# EasyEDA Pro project Clock.eprj

# Board PCB1
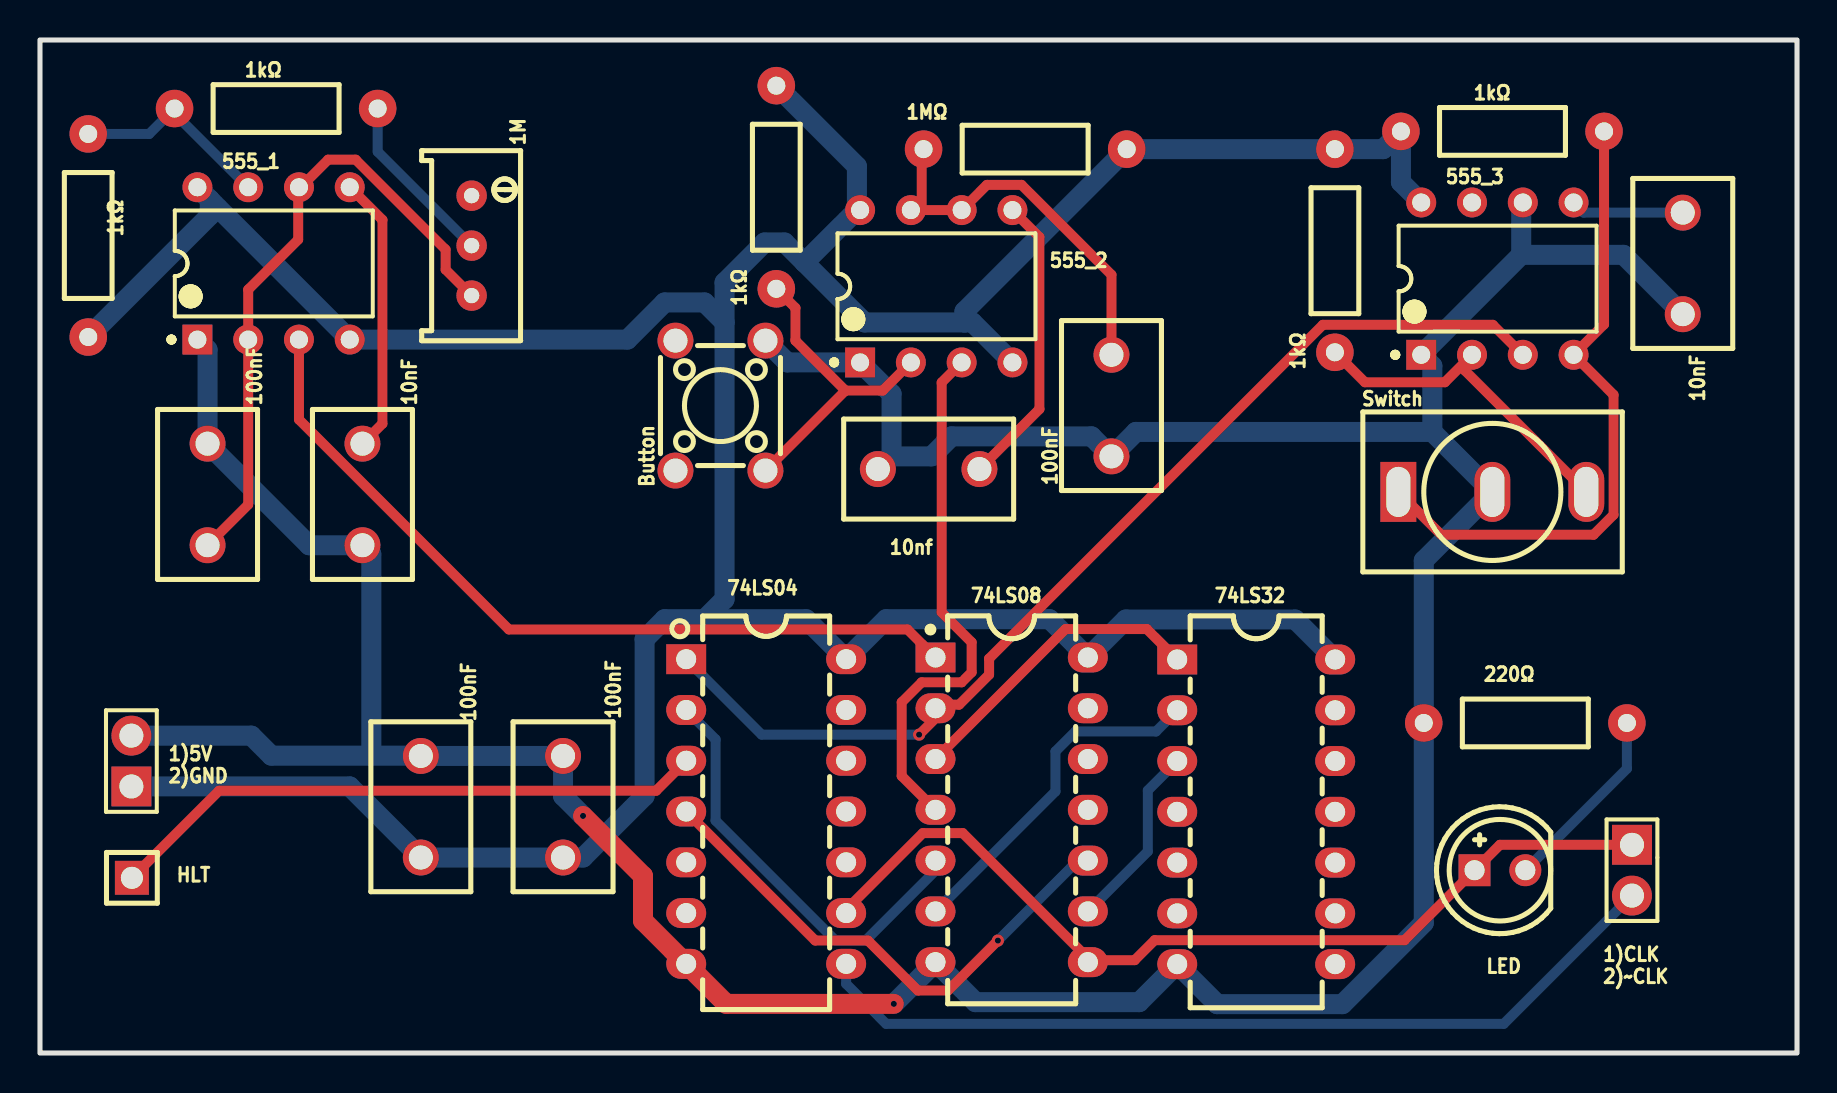
[diagram p0: board, top side]
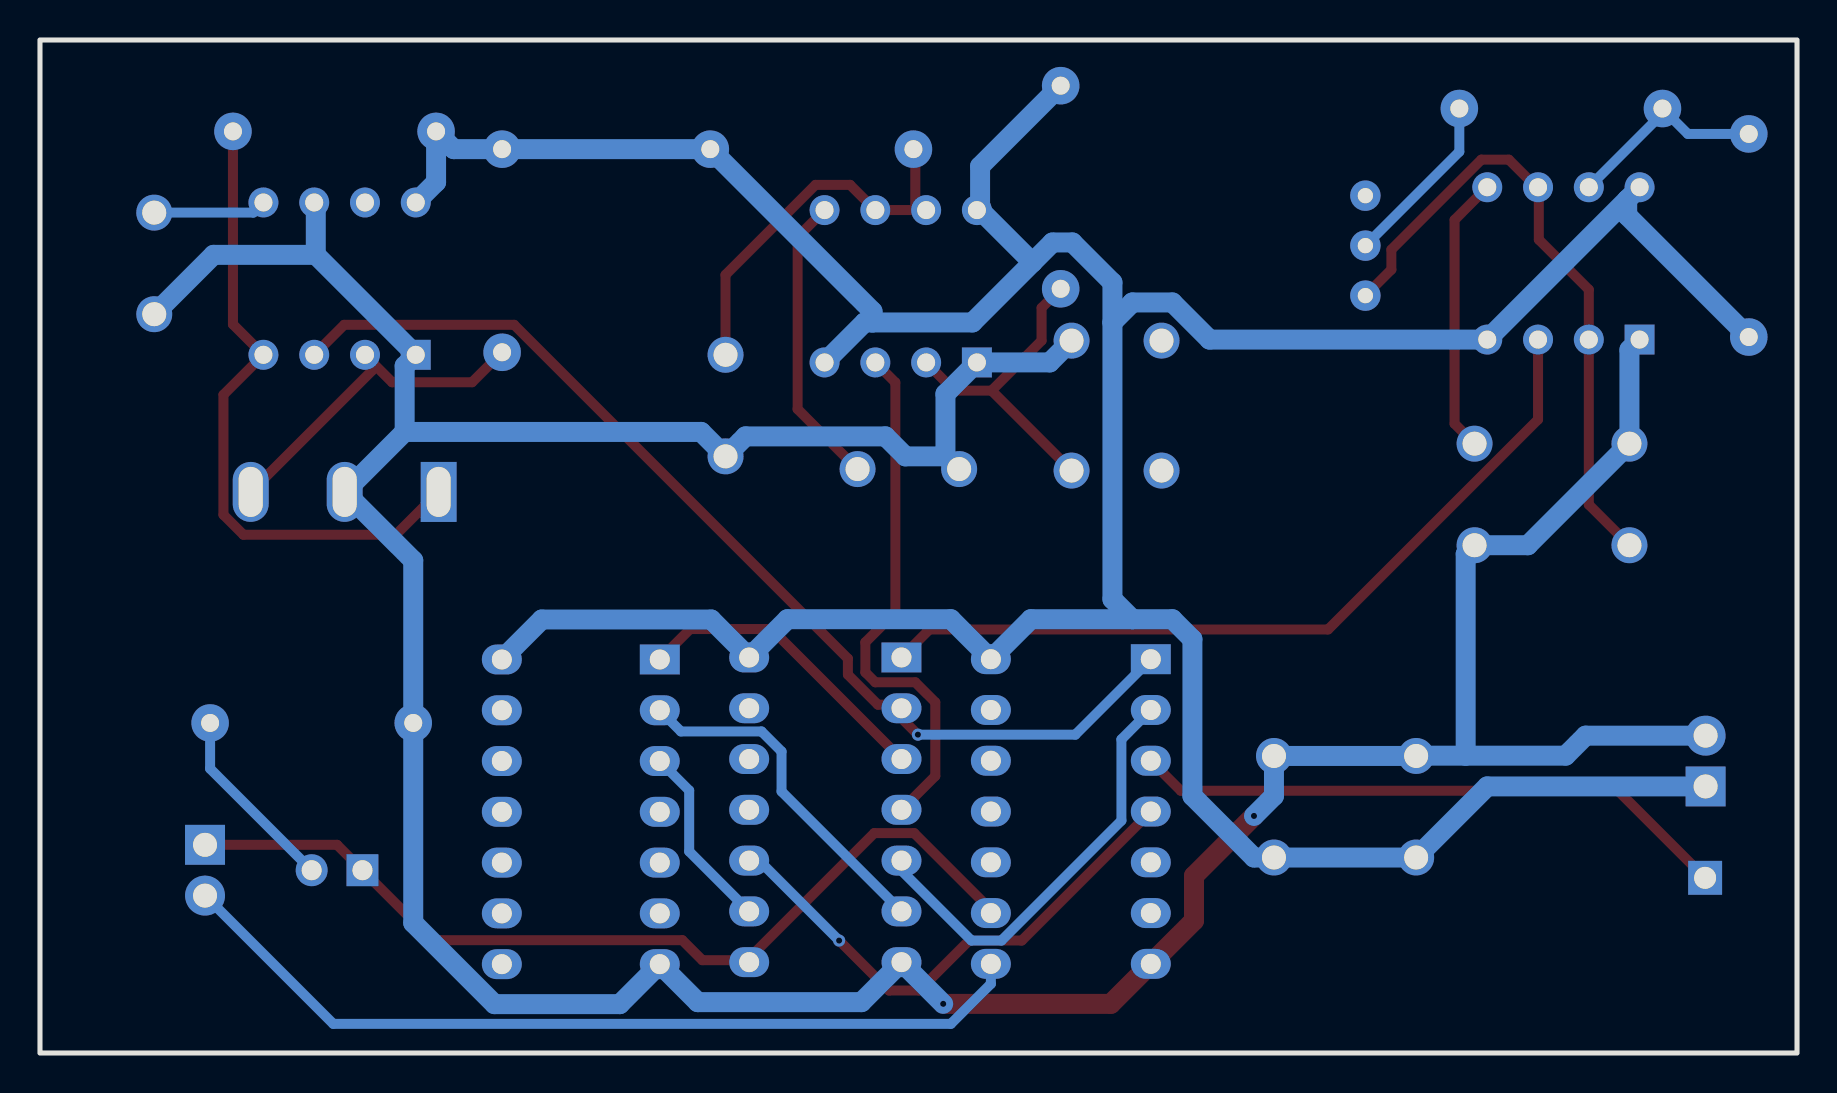
[diagram p1: board, bottom side, seen from below]

Outline 87.88 x 50.67 mm; copper layers: Top Layer, Bottom Layer. Coordinates in mm from the lower left corner of the outline.
Outline path: rectangle 0,50.67 87.88,0
Stack: Top Layer 0.035mm / Dielectric1 1.51mm FR4 er 4.5 / Bottom Layer 0.035mm

## Design rules (mm)
template: Custom Config
spacing copperThickness1oz (default): track to track 0.102, other pairs 0.152 to 0.3
spacing copperThickness2oz: track to track 0.203, other pairs 0.152 to 0.3
track width copperThickness1oz (default): min 0.127, default 0.5, max 2.54
track width copperThickness2oz: min 0.203, default 1, max 2.54
differential pair differentialPair (default): width min 0.127, default 0.254, max 2.54; gap min 0.152, default 0.152
via viaSize (default): diameter min 0.5, default 0.61, max 10; hole min 0.3, default 0.305, max 6.3
net +5V uses copperThickness2oz
net GND uses copperThickness2oz

## Placement (name value [footprint] x y rotation side)
1)5V
2)GND  -  [HDR-TH_2P-P2.54-V-M]  4.57 14.61 90 top
1)CLK
2)~CLK  -  [HDR-TH_2P-P2.54-V-M]  79.63 9.14 270 top
1kΩ  -  [R_AXIAL-0.4]  2.41 40.89 270 top
1kΩ#2  -  [R_AXIAL-0.4]  11.81 47.24 0 top
1kΩ#3  -  [R_AXIAL-0.4]  64.77 40.13 90 top
1kΩ#4  -  [R_AXIAL-0.4]  73.15 46.1 180 top
1kΩ#5  -  [R_AXIAL-0.4]  36.83 43.31 90 top
1M  -  [RES-ADJ-TH_3P-L10.0-W10.0-P2.50-L]  21.59 40.39 270 top
1MΩ  -  [R_AXIAL-0.4]  49.28 45.21 0 top
10nF  -  [CAP-TH_L8.5-W5.0-P5.00-D1.2]  16.13 27.94 270 top
10nf  -  [CAP-TH_L8.5-W5.0-P5.00-D1.2]  44.45 29.21 0 top
10nF#2  -  [CAP-TH_L8.5-W5.0-P5.00-D1.2]  82.17 39.5 90 top
74LS04  -  [PDIP-14_L19.7-W6.6-P2.54-LS8.3-BL]  36.32 12.08 270 top
74LS08  -  [PDIP-14_L19.3-W6.4-P2.54-LS7.9-BL-1]  48.6 12.17 270 top
74LS32  -  [PDIP-14_L19.6-W6.5-P2.54-LS7.9-BL]  60.83 12.06 270 top
100nF  -  [CAP-TH_L8.5-W5.0-P5.00-D1.2]  8.38 27.94 270 top
100nF#2  -  [CAP-TH_L8.5-W5.0-P5.00-D1.2]  53.59 32.39 90 top
100nF#3  -  [CAP-TH_L8.5-W5.0-P5.00-D1.2]  26.16 12.32 270 top
100nF#4  -  [CAP-TH_L8.5-W5.0-P5.00-D1.2]  19.05 12.32 270 top
220Ω  -  [R_AXIAL-0.4]  74.3 16.51 0 top
555_1  -  [DIP-8_L9.8-W6.6-P2.54-LS7.6-BL]  11.68 39.5 0 top
555_2  -  [DIP-8_L9.8-W6.6-P2.54-LS7.6-BL]  44.83 38.35 0 top
555_3  -  [DIP-8_L9.8-W6.6-P2.54-LS7.6-BL]  72.9 38.73 0 top
Button  -  [SW-TH_4P-L6.0-W6.0-P4.50-LS6.5]  34.04 32.39 90 top
HLT  -  [HDR-TH_1P-P2.54-V-M]  4.6 8.76 0 top
LED  -  [LED-TH_BD5.8-P2.54-FD]  73.03 9.14 0 top
Switch  -  [SW-TH_MT-0-103-A101-M200-RS]  72.64 28.07 0 top

## Footprints (pads in the part's own frame, mm; a bottom-side part is the same pattern mirrored in y, then rotated)
CAP-TH_L8.5-W5.0-P5.00-D1.2
  round 1.8 hole 1.2: 1(-2.54,0) 2(2.54,0)
DIP-8_L9.8-W6.6-P2.54-LS7.6-BL
  rect 1.5x1.5 hole 0.9: 1(-3.81,-3.81)
  round 1.5 hole 0.9: 2(-1.27,-3.81) 3(1.27,-3.81) 4(3.81,-3.81) 5(3.81,3.81) 6(1.27,3.81) 7(-1.27,3.81) 8(-3.81,3.81)
HDR-TH_1P-P2.54-V-M
  rect 1.7x1.7 hole 1.1: 1(0,0)
HDR-TH_2P-P2.54-V-M
  rect 2x2 hole 1.2: 1(-1.27,0)
  round 2 hole 1.2: 2(1.27,0)
LED-TH_BD5.8-P2.54-FD
  rect 1.6x1.6 hole 1: 1(-1.27,0)
  round 1.6 hole 1: 2(1.27,0)
PDIP-14_L19.3-W6.4-P2.54-LS7.9-BL-1
  rect 1.5x2 hole 1: 1(-7.62,-3.809)
  oval 1.5x2 hole 1: 2(-5.08,-3.81) 3(-2.54,-3.81) 4(0,-3.81) 5(2.54,-3.81) 6(5.08,-3.81) 7(7.62,-3.81) 8(7.62,3.81) 9(5.08,3.81) 10(2.54,3.81) 11(0,3.81) 12(-2.54,3.81) 13(-5.08,3.81) 14(-7.62,3.81)
PDIP-14_L19.6-W6.5-P2.54-LS7.9-BL
  rect 1.5x2 hole 1: 1(-7.62,-3.95)
  oval 1.5x2 hole 1: 2(-5.08,-3.95) 3(-2.54,-3.95) 4(0,-3.95) 5(2.54,-3.95) 6(5.08,-3.95) 7(7.62,-3.95) 8(7.62,3.95) 9(5.08,3.95) 10(2.54,3.95) 11(0,3.95) 12(-2.54,3.95) 13(-5.08,3.95) 14(-7.62,3.95)
PDIP-14_L19.7-W6.6-P2.54-LS8.3-BL
  rect 1.5x2 hole 1: 1(-7.62,-4)
  oval 1.5x2 hole 1: 2(-5.08,-4) 3(-2.54,-4) 4(0,-4) 5(2.54,-4) 6(5.08,-4) 7(7.62,-4) 8(7.62,4) 9(5.08,4) 10(2.54,4) 11(0,4) 12(-2.54,4) 13(-5.08,4) 14(-7.62,4)
R_AXIAL-0.4
  round 1.879 hole 0.899: 1(-5.08,0) 2(5.08,0)
RES-ADJ-TH_3P-L10.0-W10.0-P2.50-L
  round 1.524 hole 0.762: 1(-2.5,0) 2(0,0) 3(2.5,0)
SW-TH_4P-L6.0-W6.0-P4.50-LS6.5
  round 1.8 hole 1.2: 1(-3.25,2.25) 2(3.25,2.25) 3(-3.25,-2.25) 4(3.25,-2.25)
SW-TH_MT-0-103-A101-M200-RS
  rect 1.8x3 hole 1.2x2.5: 1(-4.7,0)
  oval 1.8x3 hole 1.2x2.5: 2(0,0) 3(4.7,0)

## Nets
+5V: 1)5V
2)GND.1 1kΩ.2 1kΩ#3.2 1kΩ#4.2 1kΩ#5.2 1MΩ.2 74LS04.14 74LS08.14 74LS32.14 100nF#3.2 100nF#4.2 555_1.4 555_1.8 555_2.4 555_2.8 555_3.8
GND: 1)5V
2)GND.2 10nf.1 10nF.2 10nF#2.1 74LS04.7 74LS08.7 74LS32.7 100nF.1 100nF#2.1 100nF#3.1 100nF#4.1 220Ω.1 555_1.1 555_2.1 555_3.1 555_3.6 Button.4 Switch.2
CLK: 1)CLK
2)~CLK.1 74LS04.9 74LS08.8 LED.1
HLT: 74LS04.3 HLT.1
~CLK: 1)CLK
2)~CLK.2 74LS04.8
$1N2479: 1M.3 100nF.2 555_1.2 555_1.6
$1N2481: 1kΩ#2.2 1M.2
$1N2482: 1kΩ.1 1kΩ#2.1 555_1.7
$1N2483: 10nF.1 555_1.5
$1N2484: 1MΩ.1 100nF#2.2 555_2.6 555_2.7
$1N2488: 10nF#2.2 555_3.5
$1N2489: 1kΩ#4.1 555_3.4 Switch.1
$1N2490: 1kΩ#3.1 555_3.2 Switch.3
$1N2493: 74LS08.1 555_1.3
$1N2494: 74LS08.4 555_2.3
$1N2495: 74LS04.2 74LS08.5
$1N2496: 74LS04.1 74LS08.2 555_3.3
$1N2497: 74LS08.3 74LS32.1
$1N2498: 74LS08.6 74LS32.2
$1N2500: 74LS04.4 74LS08.10
$1N2501: 74LS08.9 74LS32.3
$1N2511: 220Ω.2 LED.2
$1N2512: 10nf.2 555_2.5
$1N2513: 1kΩ#5.1 555_2.2 Button.3

Pads without a net: 1M 1; 74LS04 5 6 10 11 12 13; 74LS08 11 12 13; 74LS32 4 5 6 8 9 10 11 12 13; 555_3 7; Button 1 2

## Via types
v1: diameter 0.61, hole 0.305, Top Layer to Bottom Layer, 4 vias

## Routing (per net, layer and track width the routed paths; a pad name or vN(x,y) marks a point on that pad's centre or on a via; arc(x,y) is an arc through that point)
+5V: length 192.2
  Bottom Layer w1: 34.24,36.54 34.24,38.54 36.24,40.54 37.24,40.54 38.24,39.54 ; 34.24,36.54 34.24,22.7 33.24,21.7 ; 34.24,36.54 33.24,37.54 31.24,37.54 29.38,35.69 555_1.4 8.49,42.69 ; 38.24,39.54 40.86,42.16 ; 38.24,39.54 41.24,36.54 46.24,36.54 ; 74LS32.14 62.78,21.69 54.31,21.69 74LS08.14 50.5,21.7 42.32,21.7 74LS04.14 38.32,21.7 33.24,21.7 ; 33.24,21.7 31.24,21.7 30.24,20.7 30.24,12.86 27.16,9.78 100nF#3.2 100nF#4.2 15.49,13.34 1)5V
2)GND.1 ; 1kΩ#5.2 40.86,44.36 40.86,42.16 ; 40.86,42.16 555_2.8 ; 555_2.4 46.64,36.54 46.24,36.54 ; 8.49,42.69 8.49,41.89 1kΩ.2 ; 8.49,42.69 555_1.8 ; 46.24,36.54 46.24,37.1 54.36,45.21 1kΩ#3.2 67.18,45.21 1kΩ#4.2 68.07,43.56 555_3.8
GND: length 193.9
  Top Layer w1: v1(42.71,2.46) 34.32,2.46 74LS04.7 30.16,6.62 30.16,8.86 v1(27.16,11.86)
  Bottom Layer w1: 1)5V
2)GND.2 10.57,15.88 11.57,14.88 16.57,14.88 ; 69.64,31.07 54.82,31.07 100nF#2.1 52.59,30.84 45.59,30.84 44.59,29.84 42.59,29.84 ; 69.64,31.07 69.64,34.37 555_3.1 74.09,39.92 ; 69.64,31.07 Switch.2 69.22,24.64 220Ω.1 69.22,6.51 65.15,2.45 58.88,2.45 74LS32.7 54.98,2.55 46.79,2.55 74LS08.7 v1(42.71,2.46) ; 555_1.1 8.38,35.18 100nF.1 13.46,25.4 16.13,25.4 16.57,24.96 16.57,14.88 ; 555_3.6 74.09,42.47 74.09,39.92 ; 74.09,39.92 79.2,39.92 10nF#2.1 ; 42.59,29.84 10nf.1 ; 42.59,29.84 42.59,32.97 555_2.1 37.38,34.54 Button.4 ; 16.57,14.88 19.03,14.88 100nF#4.1 100nF#3.1 26.16,12.86 v1(27.16,11.86)
CLK: length 46.2
  Top Layer w0.5: 52.51,4.64 54.75,4.64 55.75,5.64 68.25,5.64 LED.1 73.03,10.41 1)CLK
2)~CLK.1 ; 52.51,4.64 46.16,11 44.16,11 40.32,7.17 74LS04.9 ; 52.51,4.64 74LS08.8
HLT: length 30.2
  Top Layer w0.5: HLT.1 8.95,13.12 30.82,13.12 74LS04.3
~CLK: length 43.8
  Bottom Layer w0.5: 79.63,7.87 73.21,1.46 42.32,1.46 40.32,3.46 74LS04.8
$1N2479: length 32.5
  Top Layer w0.5: 12.91,43.19 12.91,40.69 10.41,38.19 555_1.2 10.41,27.43 8.38,25.4 ; 12.91,43.19 14.41,44.69 15.79,44.69 20.29,40.19 20.29,39.19 1M.3 ; 12.91,43.19 555_1.6
$1N2481: length 8.8
  Bottom Layer w0.5: 1M.2 16.89,45.09 1kΩ#2.2
$1N2482: length 10.3
  Bottom Layer w0.5: 1kΩ.1 5.46,45.97 1kΩ#2.1 6.73,46.99 555_1.7
$1N2483: length 13.9
  Top Layer w0.5: 10nF.1 17.13,31.48 17.13,41.67 555_1.5
$1N2484: length 19.5
  Top Layer w0.5: 44.1,42.16 555_2.6 47.36,43.42 49.09,43.42 53.59,38.92 100nF#2.2 ; 44.1,42.16 44.1,45.12 1MΩ.1 ; 44.1,42.16 555_2.7
$1N2488: length 5.7
  Bottom Layer w0.5: 10nF#2.2 77.22,42.04 555_3.5
$1N2489: length 32.7
  Top Layer w0.5: 78.23,46.1 78.23,36.45 555_3.4 78.71,32.92 78.71,26.92 77.71,25.92 70.09,25.92 Switch.1
$1N2490: length 17.1
  Top Layer w0.5: Switch.3 71.27,34.14 71.27,34.55 ; 1kΩ#3.1 66.27,33.55 70.27,33.55 71.27,34.55 ; 71.27,34.55 555_3.2
$1N2493: length 40.8
  Top Layer w0.5: 74LS08.1 43.39,21.19 23.45,21.19 12.95,31.69 555_1.3
$1N2494: length 26.7
  Top Layer w0.5: 74LS08.4 43.1,13.86 43.1,17.54 44.1,18.54 46.1,18.54 46.6,19.04 46.6,20.54 45.1,22.04 45.1,33.54 555_2.3
$1N2495: length 21.6
  Bottom Layer w0.5: 74LS08.5 44.79,9.12 41.29,5.62 39.79,5.62 33.79,11.62 33.79,15.69 74LS04.2
$1N2496: length 53.5
  Top Layer w0.5: 44.97,17.42 44.97,16.92 v1(43.97,15.92) ; 44.97,17.42 74LS08.2 ; 44.97,17.42 45.97,17.42 47.47,18.92 47.47,19.73 64.17,36.42 72.67,36.42 555_3.3
  Bottom Layer w0.5: v1(43.97,15.92) 36.1,15.92 74LS04.1
$1N2497: length 15.4
  Top Layer w0.5: 74LS32.1 55.36,21.2 51.29,21.2 74LS08.3
$1N2498: length 17.4
  Bottom Layer w0.5: 74LS08.6 50.79,13.09 50.79,15.09 51.79,16.09 55.82,16.09 74LS32.2
$1N2500: length 26.5
  Top Layer w0.5: 74LS04.4 38.78,5.62 41.41,5.62 43.91,3.12 45.41,3.12 v1(47.91,5.62)
  Bottom Layer w0.5: v1(47.91,5.62) 51.91,9.62 74LS08.10
$1N2501: length 9.4
  Bottom Layer w0.5: 74LS08.9 55.41,10.09 55.41,13.13 74LS32.3
$1N2511: length 9.5
  Bottom Layer w0.5: 220Ω.2 79.38,14.22 LED.2
$1N2512: length 14.8
  Top Layer w0.5: 555_2.5 49.99,40.81 49.99,32.21 10nf.2
$1N2513: length 16
  Top Layer w0.5: Button.3 40.29,33.14 ; 40.29,33.14 37.79,35.64 37.79,37.27 1kΩ#5.1 ; 40.29,33.14 42.15,33.14 555_2.2
